# EAGLE design untitled (EAGLE 7.4.0)
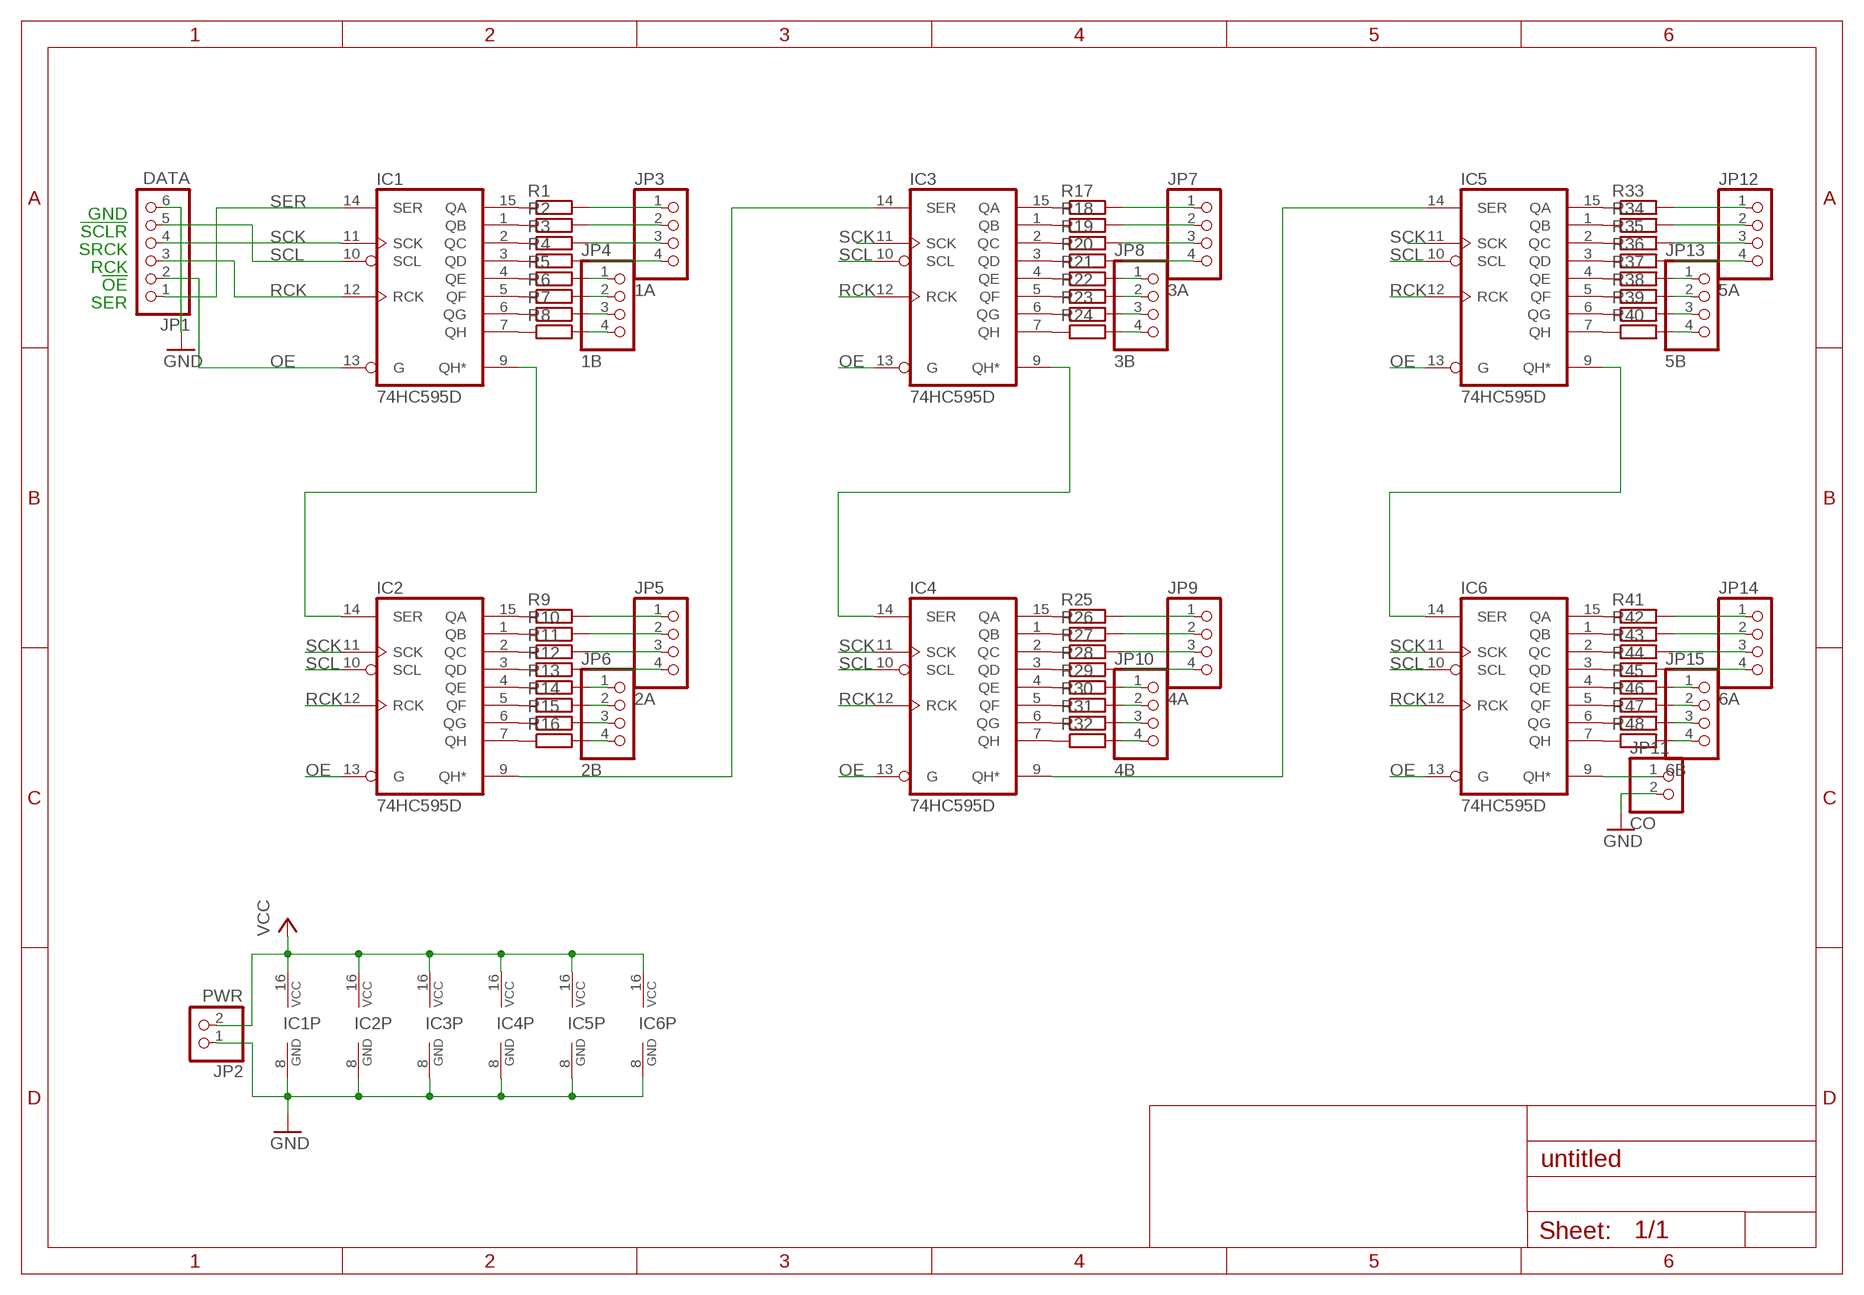
[diagram p0: schematic, sheet 1]

## Parts
IC1  74HC595D  [SO16]
IC2  74HC595D  [SO16]
IC3  74HC595D  [SO16]
IC4  74HC595D  [SO16]
IC5  74HC595D  [SO16]
IC6  74HC595D  [SO16]
JP1  DATA  PINHD-1X6  [1X06]
JP2  PWR  PINHD-1X2  [1X02]
JP3  1A  PINHD-1X4  [1X04]
JP4  1B  PINHD-1X4  [1X04]
JP5  2A  PINHD-1X4  [1X04]
JP6  2B  PINHD-1X4  [1X04]
JP7  3A  PINHD-1X4  [1X04]
JP8  3B  PINHD-1X4  [1X04]
JP9  4A  PINHD-1X4  [1X04]
JP10  4B  PINHD-1X4  [1X04]
JP11  CO  PINHD-1X2  [1X02]
JP12  5A  PINHD-1X4  [1X04]
JP13  5B  PINHD-1X4  [1X04]
JP14  6A  PINHD-1X4  [1X04]
JP15  6B  PINHD-1X4  [1X04]
R1  R-EU_R0805  [R0805]
R2  R-EU_R0805  [R0805]
R3  R-EU_R0805  [R0805]
R4  R-EU_R0805  [R0805]
R5  R-EU_R0805  [R0805]
R6  R-EU_R0805  [R0805]
R7  R-EU_R0805  [R0805]
R8  R-EU_R0805  [R0805]
R9  R-EU_R0805  [R0805]
R10  R-EU_R0805  [R0805]
R11  R-EU_R0805  [R0805]
R12  R-EU_R0805  [R0805]
R13  R-EU_R0805  [R0805]
R14  R-EU_R0805  [R0805]
R15  R-EU_R0805  [R0805]
R16  R-EU_R0805  [R0805]
R17  R-EU_R0805  [R0805]
R18  R-EU_R0805  [R0805]
R19  R-EU_R0805  [R0805]
R20  R-EU_R0805  [R0805]
R21  R-EU_R0805  [R0805]
R22  R-EU_R0805  [R0805]
R23  R-EU_R0805  [R0805]
R24  R-EU_R0805  [R0805]
R25  R-EU_R0805  [R0805]
R26  R-EU_R0805  [R0805]
R27  R-EU_R0805  [R0805]
R28  R-EU_R0805  [R0805]
R29  R-EU_R0805  [R0805]
R30  R-EU_R0805  [R0805]
R31  R-EU_R0805  [R0805]
R32  R-EU_R0805  [R0805]
R33  R-EU_R0805  [R0805]
R34  R-EU_R0805  [R0805]
R35  R-EU_R0805  [R0805]
R36  R-EU_R0805  [R0805]
R37  R-EU_R0805  [R0805]
R38  R-EU_R0805  [R0805]
R39  R-EU_R0805  [R0805]
R40  R-EU_R0805  [R0805]
R41  R-EU_R0805  [R0805]
R42  R-EU_R0805  [R0805]
R43  R-EU_R0805  [R0805]
R44  R-EU_R0805  [R0805]
R45  R-EU_R0805  [R0805]
R46  R-EU_R0805  [R0805]
R47  R-EU_R0805  [R0805]
R48  R-EU_R0805  [R0805]

## Nets
GND: IC1.8(GND) IC2.8(GND) IC3.8(GND) IC4.8(GND) IC5.8(GND) IC6.8(GND) JP1.6 JP2.1 JP11.2
N$1: IC2.15(QA) R9.1
N$2: IC1.15(QA) R1.1
N$3: IC1.1(QB) R2.1
N$4: IC1.2(QC) R3.1
N$5: IC1.3(QD) R4.1
N$6: IC1.4(QE) R5.1
N$7: IC1.5(QF) R6.1
N$8: IC1.6(QG) R7.1
N$9: IC1.7(QH) R8.1
N$10: IC2.1(QB) R10.1
N$11: IC2.2(QC) R11.1
N$12: IC2.3(QD) R12.1
N$13: IC2.4(QE) R13.1
N$14: IC2.5(QF) R14.1
N$15: IC2.6(QG) R15.1
N$16: IC2.7(QH) R16.1
N$17: JP5.1 R9.2
N$18: JP5.2 R10.2
N$19: JP3.1 R1.2
N$20: JP3.2 R2.2
N$21: JP3.3 R3.2
N$22: JP3.4 R4.2
N$23: JP4.1 R5.2
N$24: JP4.2 R6.2
N$25: JP4.3 R7.2
N$26: JP4.4 R8.2
N$27: JP5.3 R11.2
N$28: JP5.4 R12.2
N$29: JP6.1 R13.2
N$30: JP6.2 R14.2
N$31: JP6.3 R15.2
N$32: JP6.4 R16.2
N$33: IC1.9(QH*) IC2.14(SER)
N$34: IC3.15(QA) R17.1
N$35: IC3.1(QB) R18.1
N$36: IC3.2(QC) R19.1
N$37: IC3.3(QD) R20.1
N$38: IC3.4(QE) R21.1
N$39: IC3.5(QF) R22.1
N$40: IC3.6(QG) R23.1
N$41: IC3.7(QH) R24.1
N$42: JP7.1 R17.2
N$43: JP7.2 R18.2
N$44: JP7.3 R19.2
N$45: JP7.4 R20.2
N$46: JP8.1 R21.2
N$47: JP8.2 R22.2
N$48: JP8.3 R23.2
N$49: JP8.4 R24.2
N$50: IC4.15(QA) R25.1
N$51: IC4.1(QB) R26.1
N$52: IC4.2(QC) R27.1
N$53: IC4.3(QD) R28.1
N$54: IC4.4(QE) R29.1
N$55: IC4.5(QF) R30.1
N$56: IC4.6(QG) R31.1
N$57: IC4.7(QH) R32.1
N$58: JP9.1 R25.2
N$59: JP9.2 R26.2
N$60: JP9.3 R27.2
N$61: JP9.4 R28.2
N$62: JP10.1 R29.2
N$63: JP10.2 R30.2
N$64: JP10.3 R31.2
N$65: JP10.4 R32.2
N$66: IC3.9(QH*) IC4.14(SER)
N$67: IC2.9(QH*) IC3.14(SER)
N$68: IC6.9(QH*) JP11.1
N$69: IC5.15(QA) R33.1
N$70: IC5.1(QB) R34.1
N$71: IC5.2(QC) R35.1
N$72: IC5.3(QD) R36.1
N$73: IC5.4(QE) R37.1
N$74: IC5.5(QF) R38.1
N$75: IC5.6(QG) R39.1
N$76: IC5.7(QH) R40.1
N$77: JP12.1 R33.2
N$78: JP12.2 R34.2
N$79: JP12.3 R35.2
N$80: JP12.4 R36.2
N$81: JP13.1 R37.2
N$82: JP13.2 R38.2
N$83: JP13.3 R39.2
N$84: JP13.4 R40.2
N$85: IC6.15(QA) R41.1
N$86: IC6.1(QB) R42.1
N$87: IC6.2(QC) R43.1
N$88: IC6.3(QD) R44.1
N$89: IC6.4(QE) R45.1
N$90: IC6.5(QF) R46.1
N$91: IC6.6(QG) R47.1
N$92: IC6.7(QH) R48.1
N$93: JP14.1 R41.2
N$94: JP14.2 R42.2
N$95: JP14.3 R43.2
N$96: JP14.4 R44.2
N$97: JP15.1 R45.2
N$98: JP15.2 R46.2
N$99: JP15.3 R47.2
N$100: JP15.4 R48.2
N$101: IC5.9(QH*) IC6.14(SER)
N$102: IC4.9(QH*) IC5.14(SER)
OE: IC1.13(G) IC2.13(G) IC3.13(G) IC4.13(G) IC5.13(G) IC6.13(G) JP1.2
RCK: IC1.12(RCK) IC2.12(RCK) IC3.12(RCK) IC4.12(RCK) IC5.12(RCK) IC6.12(RCK) JP1.3
SCK: IC1.11(SCK) IC2.11(SCK) IC3.11(SCK) IC4.11(SCK) IC5.11(SCK) IC6.11(SCK) JP1.4
SCL: IC1.10(SCL) IC2.10(SCL) IC3.10(SCL) IC4.10(SCL) IC5.10(SCL) IC6.10(SCL) JP1.5
SER: IC1.14(SER) JP1.1
VCC: IC1.16(VCC) IC2.16(VCC) IC3.16(VCC) IC4.16(VCC) IC5.16(VCC) IC6.16(VCC) JP2.2

## Notes on the sheet
- GND
- !SCLR
- SRCK
- RCK
- !OE
- SER

## Library data of the parts
IC1-IC6 = 74xx-eu:74*595: 8-bit SHIFT REGISTER, output latch
JP1 = pinhead:PINHD-1X6: PIN HEADER
JP2 JP11 = pinhead:PINHD-1X2: PIN HEADER
JP3-JP10 JP12-JP15 = pinhead:PINHD-1X4: PIN HEADER
R1-R48 = rcl:R-EU_: RESISTOR, European symbol

## Board
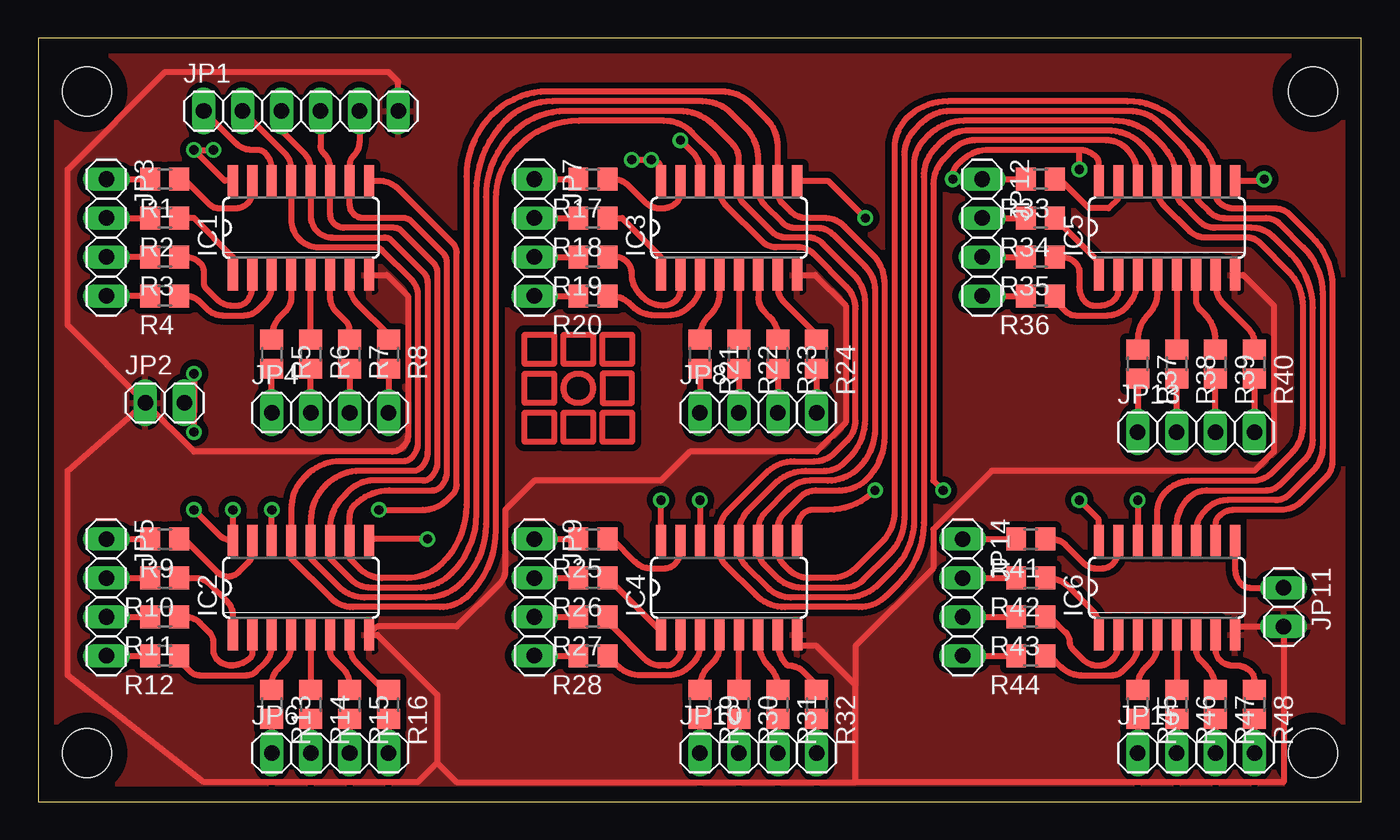
[diagram p1: board, top side]
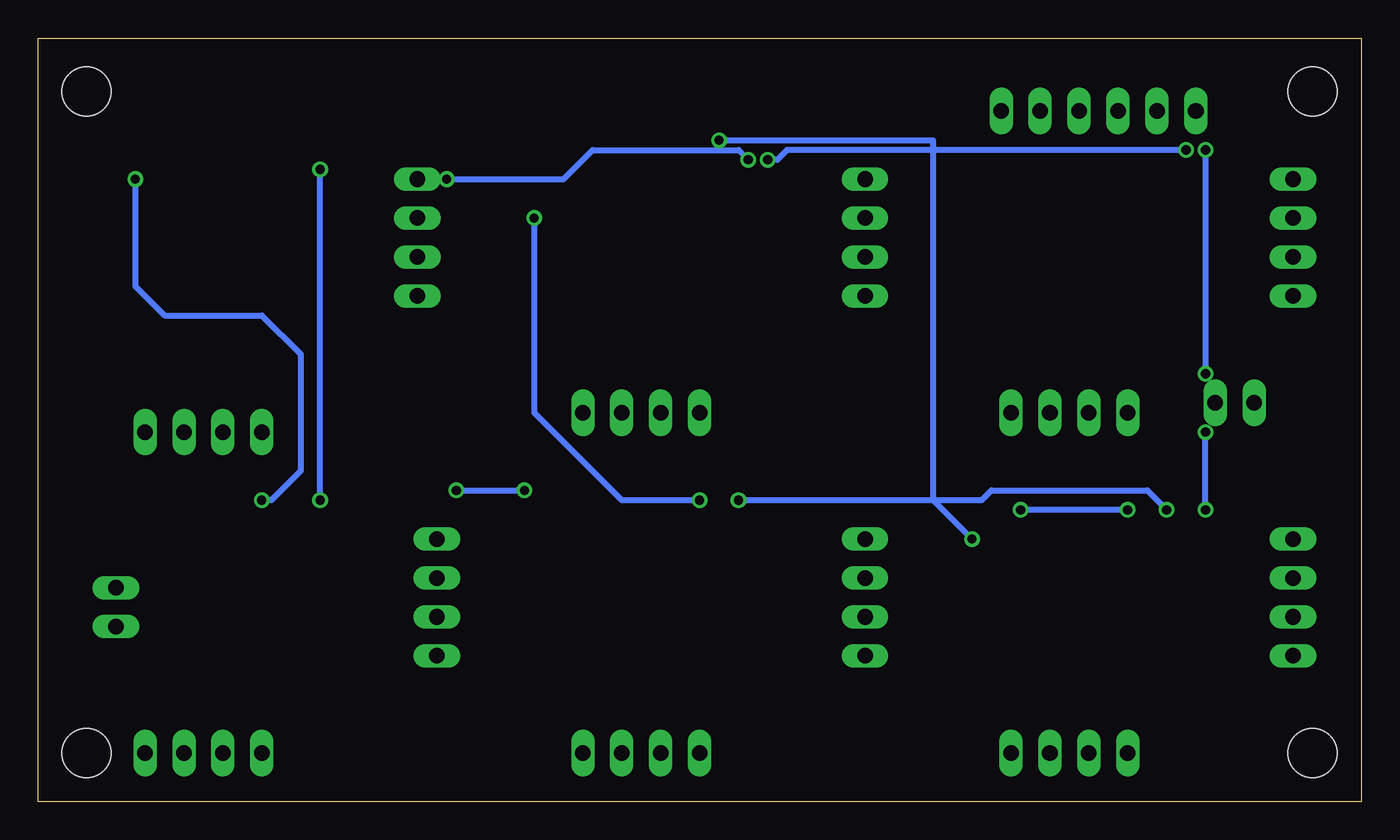
[diagram p2: board, bottom side, seen from below]

Size 86.34 x 49.84 mm. Coordinates in mm from the lower left corner, seen from the top.
Outline: 0,0 86.34,0 86.34,49.84 0,49.84 0,0
Copper layers (1*16): Top 0.035mm / dielectric 1.5mm / Bottom 0.035mm
Design rules "default": minimum track width 10mil, minimum drill 24mil, track to track 8mil, track to pad 8mil, pad to pad 8mil, via to via 8mil, smd to smd 8mil, copper to edge 40mil, drill to drill 8mil, minimum pad ring 10mil, minimum via ring 8mil, stop-mask expansion 4mil, vias tented up to drill 0mil, thermal gap 10mil
Holes 3.2 mm at 3.17,46.35 83.19,46.35 83.19,3.17 3.17,3.17

### Footprints (pad centres in the part's own frame; a part is rotated, then mirrored left to right if it is on the bottom)
SO16 = smd 0.66 x 2.032: 1 -4.445,-3.073; 2 -3.175,-3.073; 3 -1.905,-3.073; 4 -0.635,-3.073; 5 0.635,-3.073; 6 1.905,-3.073; 7 3.175,-3.073; 8 4.445,-3.073; 9 4.445,3.073; 10 3.175,3.073; 11 1.905,3.073; 12 0.635,3.073; 13 -0.635,3.073; 14 -1.905,3.073; 15 -3.175,3.073; 16 -4.445,3.073
1X06 = drill 1.016 long: 1 -6.35,0; 2 -3.81,0; 3 -1.27,0; 4 1.27,0; 5 3.81,0; 6 6.35,0
1X02 = drill 1.016 long: 1 -1.27,0; 2 1.27,0
1X04 = drill 1.016 long: 1 -3.81,0; 2 -1.27,0; 3 1.27,0; 4 3.81,0
R0805 = smd 1.3 x 1.5: 1 -0.95,0; 2 0.95,0

### Placement (x,y rotation side)
IC1  17.14,37.47 0 top
IC2  17.14,13.97 0 top
IC3  45.09,37.47 0 top
IC4  45.09,13.97 0 top
IC5  73.66,37.47 0 top
IC6  73.66,13.97 0 top
JP1  17.14,45.09 0 top
JP2  8.26,26.04 0 top
JP3  4.45,36.83 270 top
JP4  19.05,25.4 0 top
JP5  4.45,13.34 270 top
JP6  19.05,3.17 0 top
JP7  32.38,36.83 270 top
JP8  46.99,25.4 0 top
JP9  32.38,13.34 270 top
JP10  46.99,3.17 0 top
JP11  81.28,12.7 270 top
JP12  61.59,36.83 270 top
JP13  75.56,24.13 0 top
JP14  60.33,13.34 270 top
JP15  75.56,3.17 0 top
R1  8.26,40.64 180 top
R2  8.26,38.1 180 top
R3  8.26,35.56 180 top
R4  8.26,33.02 180 top
R5  15.24,29.21 270 top
R6  17.78,29.21 270 top
R7  20.32,29.21 270 top
R8  22.86,29.21 270 top
R9  8.26,17.14 180 top
R10  8.26,14.61 180 top
R11  8.26,12.06 180 top
R12  8.26,9.53 180 top
R13  15.24,6.35 270 top
R14  17.78,6.35 270 top
R15  20.32,6.35 270 top
R16  22.86,6.35 270 top
R17  36.2,40.64 180 top
R18  36.2,38.1 180 top
R19  36.2,35.56 180 top
R20  36.2,33.02 180 top
R21  43.18,29.21 270 top
R22  45.72,29.21 270 top
R23  48.26,29.21 270 top
R24  50.8,29.21 270 top
R25  36.2,17.14 180 top
R26  36.2,14.61 180 top
R27  36.2,12.06 180 top
R28  36.2,9.53 180 top
R29  43.18,6.35 270 top
R30  45.72,6.35 270 top
R31  48.26,6.35 270 top
R32  50.8,6.35 270 top
R33  65.41,40.64 180 top
R34  65.41,38.1 180 top
R35  65.41,35.56 180 top
R36  65.41,33.02 180 top
R37  71.75,28.57 270 top
R38  74.3,28.57 270 top
R39  76.83,28.57 270 top
R40  79.38,28.57 270 top
R41  64.77,17.14 180 top
R42  64.77,14.61 180 top
R43  64.77,12.06 180 top
R44  64.77,9.53 180 top
R45  71.75,6.35 270 top
R46  74.3,6.35 270 top
R47  76.83,6.35 270 top
R48  79.38,6.35 270 top

### Tracks (layer width: path | path; a pad name or v marks a point on that pad's centre or on a via)
GND
  Top 0.406: JP1.6 23.5,46.99 22.86,47.62 8.26,47.62 1.91,41.27 1.91,31.11 JP2.1 | IC1.8 22.76,34.39 24.13,33.02 24.13,23.87 arc-45 23.87,23.23 23.76,23.12 arc-45 23.12,22.86 10.16,22.86 JP2.1 | 26.04,2.54 24.77,1.27 10.79,1.27 1.91,8.26 1.91,21.59 JP2.1 | IC5.8 78.64,34.39 80.64,32.38 80.64,22.86 79.38,21.59 62.23,21.59 58.42,17.78 58.42,15.24 53.34,10.16 53.34,7.62 | 26.04,2.54 26.04,6.99 22.12,10.9 IC2.8 22.12,11.43 27.3,11.43 30.11,14.23 arc45 30.48,15.13 30.48,19.05 32.38,20.95 40.64,20.95 42.55,22.86 50.8,22.86 52.7,24.77 52.7,32.38 50.7,34.39 IC3.8 | 26.04,2.54 27.3,1.27 53.34,1.27 | 53.34,1.27 53.34,7.62 | 53.34,7.62 50.8,10.16 49.53,10.16 | IC6.8 78.11,11.43 JP11.2 81.28,1.27 53.34,1.27
  pour Top (isolate 0.406): 0,49.53 86.36,49.53 86.36,0 0,0
N$1
  Top 0.406: R9.1 9.53,17.14 11.67,15 arc90 13.09,15 13.71,15.61 arc45 13.97,16.25 IC2.15
N$2
  Top 0.406: R1.1 9.53,40.64 11.17,39 arc45 11.8,38.73 12.81,38.73 arc45 13.71,39.11 arc45 13.97,39.74 IC1.15
N$3
  Top 0.406: IC1.1 12.7,35.56 10.16,38.1 R2.1
N$4
  Top 0.406: R3.1 9.63,35.56 arc-45 10.53,35.19 10.61,35.11 arc-45 10.79,34.66 10.79,33.92 arc45 10.98,33.47 11.65,32.8 arc45 12.65,32.38 13.03,32.38 arc45 13.55,32.6 arc45 13.97,33.61 IC1.2
N$5
  Top 0.406: R4.1 9.63,33.02 arc-45 10.53,32.65 11.01,32.17 arc45 12.02,31.75 13.44,31.75 arc45 14.34,32.12 14.82,32.6 arc45 15.24,33.61 IC1.3
N$6
  Top 0.406: IC1.4 16.51,32.97 arc-45 16.09,31.97 15.77,31.64 arc45 15.24,30.37 R5.1
N$7
  Top 0.406: R6.1 IC1.5
N$8
  Top 0.406: R7.1 20.32,30.74 arc45 20.06,31.38 19.47,31.97 arc-45 19.05,32.97 IC1.6
N$9
  Top 0.406: R8.1 22.86,30.48 20.85,32.49 arc-45 20.32,33.76 IC1.7
N$10
  Top 0.406: R10.1 10.27,14.61 arc-45 11.17,14.23 12.28,13.12 arc-45 12.7,12.11 IC2.1
N$11
  Top 0.406: IC2.2 13.97,9.68 arc-45 13.86,9.42 arc-45 12.59,8.89 | 12.59,8.89 | 12.59,8.89 arc-45 11.69,9.26 arc-45 11.43,9.9 11.43,10.42 arc45 11.17,11.06 10.58,11.65 arc45 9.57,12.06 R11.1
N$12
  Top 0.406: R12.1 9.21,9.21 9.9,8.52 arc45 10.53,8.26 13.6,8.26 arc45 14.23,8.52 14.82,9.11 arc45 15.24,10.11 IC2.3
N$13
  Top 0.406: R13.1 15.24,7.67 arc-45 15.66,8.67 16.09,9.11 arc45 16.51,10.11 IC2.4
N$14
  Top 0.406: IC2.5 R14.1
N$15
  Top 0.406: R15.1 20.32,7.67 arc45 19.9,8.67 19.24,9.34 arc-45 19.05,9.79 IC2.6
N$16
  Top 0.406: R16.1 22.55,7.3 20.85,9 arc-45 20.32,10.27 IC2.7
N$17
  Top 0.406: JP5.1 R9.2
N$18
  Top 0.406: JP5.2 R10.2
N$19
  Top 0.406: JP3.1 R1.2
N$20
  Top 0.406: JP3.2 R2.2
N$21
  Top 0.406: R3.2 JP3.3
N$22
  Top 0.406: R4.2 JP3.4
N$23
  Top 0.406: JP4.1 R5.2
N$24
  Top 0.406: JP4.2 R6.2
N$25
  Top 0.406: R7.2 JP4.3
N$26
  Top 0.406: R8.2 JP4.4
N$27
  Top 0.406: JP5.3 R11.2
N$28
  Top 0.406: JP5.4 R12.2
N$29
  Top 0.406: R13.2 JP6.1
N$30
  Top 0.406: R14.2 JP6.2
N$31
  Top 0.406: R15.2 JP6.3
N$32
  Top 0.406: R16.2 JP6.4
N$33  (via drill 0.6 pad 1.02)
  Top 0.406: IC1.9 22.21,40.54 arc-45 23.49,40.01 27.04,36.46 arc-45 27.3,35.82 27.3,20.69 arc-45 27.04,20.06 26.71,19.72 arc-45 25.09,19.05 v22.23,19.05 | IC2.14 v15.24,19.05
  Bottom 0.406: v15.24,19.05 v22.23,19.05
N$34
  Top 0.406: R17.1 37.57,40.64 arc-45 38.47,40.27 39.59,39.15 arc45 40.59,38.73 40.69,38.73 arc45 41.69,39.15 arc45 41.91,39.68 IC3.15
N$35
  Top 0.406: R18.1 38.1,38.1 40.64,35.56 IC3.1
N$36
  Top 0.406: IC3.2 41.91,33.44 arc-45 41.62,32.73 arc-45 40.79,32.38 arc-45 39.45,32.94 39.32,33.07 arc-45 38.73,34.49 arc45 38.42,35.23 arc45 37.64,35.56 R19.1
N$37
  Top 0.406: IC3.3 43.18,33.76 arc-45 42.65,32.49 42.47,32.31 arc-45 41.12,31.75 40.2,31.75 arc-45 38.78,32.34 38.69,32.43 arc45 37.27,33.02 R20.1
N$38
  Top 0.406: IC3.4 44.45,33.17 arc-45 43.89,31.83 43.71,31.64 arc45 43.18,30.37 R21.1
N$39
  Top 0.406: IC3.5 R22.1
N$40
  Top 0.406: IC3.6 46.99,32.91 arc45 47.36,32.01 47.73,31.64 arc-45 48.26,30.37 R23.1
N$41
  Top 0.406: IC3.7 48.26,33.55 arc45 48.63,32.65 50.8,30.48 R24.1
N$42
  Top 0.406: JP7.1 R17.2
N$43
  Top 0.406: JP7.2 R18.2
N$44
  Top 0.406: JP7.3 R19.2
N$45
  Top 0.406: JP7.4 R20.2
N$46
  Top 0.406: R21.2 JP8.1
N$47
  Top 0.406: R22.2 JP8.2
N$48
  Top 0.406: R23.2 JP8.3
N$49
  Top 0.406: R24.2 JP8.4
N$50
  Top 0.406: R25.1 37.47,17.14 38.95,15.66 arc45 39.96,15.24 40.9,15.24 arc45 41.54,15.5 arc45 41.91,16.4 IC4.15
N$51
  Top 0.406: IC4.1 40.64,11.11 R26.1
N$52
  Top 0.406: IC4.2 41.91,9.79 arc-45 41.72,9.34 41.46,9.08 arc-45 41.01,8.89 40.59,8.89 arc-45 39.59,9.31 37.47,11.43 37.47,11.74 R27.1
N$53
  Top 0.406: IC4.3 43.18,10.11 arc-45 42.76,9.11 42.44,8.78 arc-45 41.17,8.26 39.3,8.26 arc-45 37.79,8.88 R28.1
N$54
  Top 0.406: IC4.4 44.45,10.11 arc-45 44.03,9.11 43.71,8.78 arc45 43.18,7.51 R29.1
N$55
  Top 0.406: R30.1 IC4.5
N$56
  Top 0.406: IC4.6 46.99,10.47 arc45 47.66,8.85 47.7,8.81 arc-45 48.26,7.47 R31.1
N$57
  Top 0.406: IC4.7 48.26,10.36 arc45 48.85,8.94 arc45 48.96,8.89 arc-45 49.93,8.49 50.8,7.62 R32.1
N$58
  Top 0.406: JP9.1 R25.2
N$59
  Top 0.406: JP9.2 R26.2
N$60
  Top 0.406: JP9.3 R27.2
N$61
  Top 0.406: JP9.4 R28.2
N$62
  Top 0.406: R29.2 JP10.1
N$63
  Top 0.406: JP10.2 R30.2
N$64
  Top 0.406: JP10.3 R31.2
N$65
  Top 0.406: JP10.4 R32.2
N$66  (via drill 0.6 pad 1.02)
  Top 0.406: IC3.9 51.54,40.54 v53.98,38.1 | v43.18,19.68 IC4.14
  Bottom 0.406: v53.98,38.1 53.98,25.4 48.26,19.68 v43.18,19.68
N$67  (via drill 0.6 pad 1.02)
  Top 0.406: IC3.14 43.18,41.32 arc45 42.76,42.33 v41.91,43.18 | v25.4,17.14 21.69,17.14 IC2.9
  Bottom 0.406: v41.91,43.18 27.94,43.18 27.94,19.68 v25.4,17.14
N$68
  Top 0.406: JP11.1 79.05,13.97 arc-45 78.52,14.19 arc-45 78.11,15.19 IC6.9
N$69
  Top 0.406: IC5.15 70.48,39.37 69.85,38.73 68.58,38.73 66.67,40.64 R33.1
N$70
  Top 0.406: IC5.1 69.22,35.24 R34.1
N$71
  Top 0.406: R35.1 66.78,35.56 arc-45 67.68,35.19 arc-45 67.94,34.55 67.94,33.61 arc45 68.36,32.6 arc45 68.89,32.38 69.26,32.38 arc45 70.27,32.8 arc45 70.48,33.33 IC5.2
N$72
  Top 0.406: R36.1 66.36,32.7 67.05,32.01 arc45 67.68,31.75 69.77,31.75 arc45 70.99,32.25 arc45 71.75,34.1 IC5.3
N$73
  Top 0.406: IC5.4 73.03,33.22 arc-45 72.44,31.8 arc45 71.75,30.15 R37.1
N$74
  Top 0.406: IC5.5 R38.1
N$75
  Top 0.406: R39.1 76.83,30.17 arc45 76.16,31.79 75.83,32.12 arc-45 75.56,32.76 IC5.6
N$76
  Top 0.406: IC5.7 76.83,33.76 arc45 77.36,32.49 78.96,30.9 arc-45 79.38,29.89 R40.1
N$77
  Top 0.406: JP12.1 R33.2
N$78
  Top 0.406: JP12.2 R34.2
N$79
  Top 0.406: JP12.3 R35.2
N$80
  Top 0.406: JP12.4 R36.2
N$81
  Top 0.406: R37.2 JP13.1
N$82
  Top 0.406: JP13.2 R38.2
N$83
  Top 0.406: JP13.3 R39.2
N$84
  Top 0.406: R40.2 JP13.4
N$85
  Top 0.406: R41.1 66.15,17.14 arc-45 67.05,16.77 68.32,15.5 arc45 68.95,15.24 69.48,15.24 arc45 70.11,15.5 arc45 70.48,16.4 IC6.15
N$86
  Top 0.406: R42.1 65.89,14.61 arc-45 67.23,14.05 68.8,12.48 arc-45 69.22,11.48 IC6.1
N$87
  Top 0.406: R43.1 66.04,12.06 67.05,11.06 arc-45 67.31,10.42 arc45 67.5,9.97 68.16,9.31 arc45 69.17,8.89 arc90 70.48,10.21 IC6.2
N$88
  Top 0.406: R44.1 66.04,9.53 66.78,8.78 arc45 68.05,8.26 70.11,8.26 arc45 70.75,8.52 71.34,9.11 arc45 71.75,10.11 IC6.3
N$89
  Top 0.406: R45.1 71.75,7.51 arc-45 72.28,8.78 72.61,9.11 arc45 73.03,10.11 IC6.4
N$90
  Top 0.406: IC6.5 R46.1
N$91
  Top 0.406: IC6.6 75.56,9.9 arc45 75.83,9.26 76.16,8.93 arc-45 R47.1
N$92
  Top 0.406: IC6.7 76.83,9.9 arc45 77.1,9.26 arc45 78,8.89 78.21,8.89 arc-45 79.11,8.52 arc-45 79.38,7.88 R48.1
N$93
  Top 0.406: JP14.1 R41.2
N$94
  Top 0.406: JP14.2 R42.2
N$95
  Top 0.406: JP14.3 R43.2
N$96
  Top 0.406: JP14.4 R44.2
N$97
  Top 0.406: R45.2 JP15.1
N$98
  Top 0.406: R46.2 JP15.2
N$99
  Top 0.406: R47.2 JP15.3
N$100
  Top 0.406: R48.2 JP15.4
N$101  (via drill 0.6 pad 1.02)
  Top 0.406: IC5.9 79.91,40.54 v80.01,40.64 | v71.75,19.68 IC6.14
  Bottom 0.406: v80.01,40.64 80.01,33.66 78.11,31.75 71.75,31.75 69.22,29.21 69.22,21.59 71.12,19.68 v71.75,19.68
N$102  (via drill 0.6 pad 1.02)
  Top 0.406: IC5.14 71.75,40.9 arc45 71.04,42.62 arc45 69.7,43.18 61.11,43.18 arc45 59.77,42.62 59.09,41.95 arc45 58.42,40.33 58.42,20.95 v59.05,20.32 | v54.61,20.32 arc-45 51.54,19.05 50.54,19.05 arc45 49.9,18.79 arc45 49.53,17.89 IC4.9
  Bottom 0.406: v59.05,20.32 v54.61,20.32
N$103
  Top 0.406: 33.66,27.94 33.66,26.04 31.75,26.04 31.75,27.94 33.66,27.94
N$104
  Top 0.406: 36.2,27.04 36.2,26.93 arc-90 35.3,26.04 35.19,26.04 arc-90 34.29,26.93 34.29,27.04 arc-90 35.19,27.94 35.3,27.94 arc-90 36.2,27.04
N$105
  Top 0.406: 36.83,27.94 36.83,26.04 38.73,26.04 38.73,27.94 36.83,27.94
N$106
  Top 0.406: 31.75,25.4 33.66,25.4 33.66,23.5 31.75,23.5 31.75,25.4
N$107
  Top 0.406: 34.29,25.4 36.2,25.4 36.2,23.5 34.29,23.5 34.29,25.4
N$108
  Top 0.406: 36.83,23.5 36.83,25.4 38.73,25.4 38.73,23.5 36.83,23.5
N$109
  Top 0.406: 31.75,30.48 33.66,30.48 33.66,28.57 31.75,28.57 31.75,30.48
N$110
  Top 0.406: 34.29,30.48 36.2,30.48 36.2,28.57 34.29,28.57 34.29,30.48
N$111
  Top 0.406: 36.83,30.48 38.73,30.48 38.73,28.57 36.83,28.57 36.83,30.48
OE
  Top 0.406: JP1.2 16.09,42.33 arc-45 16.51,41.32 IC1.13 16.51,37.99 arc90 18.31,36.2 21.96,36.2 arc-45 22.41,36.01 24.35,34.07 arc-45 24.77,33.07 24.77,23.45 arc-45 24.35,22.44 arc-45 23.82,22.23 19.73,22.23 arc45 17.48,21.3 17.34,21.15 arc45 16.51,19.14 IC2.13 16.51,15.88 19.1,13.29 arc45 20.52,12.7 26.22,12.7 arc45 28.07,13.47 arc45 29.84,17.75 29.84,39.38 arc-45 31.19,42.62 31.43,42.86 arc-45 35.27,44.45 40.83,44.45 arc-45 42.68,43.68 44.03,42.33 arc-45 44.45,41.32 IC3.13 44.45,39.96 arc45 44.87,38.95 47.25,36.57 arc45 48.15,36.2 49.58,36.2 arc-45 50.58,35.78 52.75,33.61 arc-45 53.34,32.19 53.34,24.87 arc-45 52.81,23.6 51.99,22.78 arc-45 50.65,22.23 49.34,22.23 arc45 47.49,21.46 45.04,19 arc45 44.45,17.58 IC4.13 44.45,16.4 arc45 44.82,15.5 46.84,13.49 arc45 48.74,12.7 53.56,12.7 arc45 55.35,13.44 56.12,14.21 arc45 57.78,18.23 57.78,40.79 arc-45 58.57,42.7 58.95,43.07 arc-45 60.74,43.81 69.78,43.81 arc-45 72.07,42.87 arc-45 73.03,40.56 IC5.13 73.03,39.96 arc45 73.44,38.95 75.15,37.25 arc45 76.15,36.83 78.85,36.83 arc-45 79.75,36.46 81.62,34.59 arc-45 82.55,32.34 82.55,24.61 arc-45 81.76,22.71 80.6,21.54 arc-45 79.18,20.95 75.24,20.95 arc45 73.62,20.28 arc45 73.03,18.84 IC6.13
RCK
  Top 0.406: JP1.3 15.88,43.81 17.36,42.33 arc-45 17.78,41.32 IC1.12 17.78,38.25 arc90 19.2,36.83 22.6,36.83 arc-45 23.05,36.64 25.14,34.55 arc-45 25.4,33.92 25.4,22.81 arc-45 24.98,21.81 arc-45 24.45,21.59 21,21.59 arc45 18.75,20.66 18.71,20.61 arc45 17.78,18.37 IC2.12 17.78,15.88 19.65,14.01 arc45 21.27,13.34 25.33,13.34 arc45 27.62,14.28 arc45 29.21,18.13 29.21,39.48 arc-45 30.93,43.62 arc-45 34.45,45.09 41.84,45.09 arc-45 44.13,44.14 45.3,42.96 arc-45 45.72,41.96 IC3.12 45.72,39.74 arc45 45.98,39.11 47.89,37.2 arc45 48.79,36.83 50.21,36.83 arc-45 51.22,36.41 53.21,34.42 arc-45 53.98,32.57 53.98,24.98 arc-45 52.92,22.44 52.63,22.15 arc-45 51.28,21.59 50.07,21.59 arc45 48.06,20.76 46.39,19.09 arc45 45.72,17.47 IC4.12 45.72,16.46 arc45 46.14,15.46 47.67,13.92 arc45 49.09,13.34 52.8,13.34 arc45 54.81,14.17 55.84,15.2 arc45 57.15,18.37 57.15,41.6 arc-45 57.82,43.22 58.11,43.5 arc-45 60.4,44.45 70.18,44.45 arc-45 72.87,43.33 73.33,42.88 arc-45 IC5.12 74.3,39.74 arc45 74.56,39.11 75.78,37.88 arc45 76.79,37.47 79.18,37.47 arc-45 80.6,36.88 81.73,35.74 arc-45 83.19,32.24 83.19,23.6 arc-45 82.66,22.33 81.02,20.69 arc-45 80.12,20.32 76.25,20.32 arc45 75.08,19.84 arc45 74.3,17.93 IC6.12
SCK
  Top 0.406: JP1.4 18.41,42.81 arc45 18.6,42.36 18.63,42.33 arc-45 19.05,41.32 IC1.11 19.05,38.36 arc90 19.95,37.47 23.23,37.47 arc-45 23.68,37.28 25.77,35.19 arc-45 26.04,34.55 26.04,22.18 arc-45 25.62,21.17 arc-45 25.09,20.95 21.64,20.95 arc45 20.02,20.02 19.82,19.82 arc45 19.05,17.97 IC2.11 19.05,15.88 20.43,14.5 arc45 21.7,13.97 24.69,13.97 arc45 26.98,14.92 arc45 28.57,18.76 28.57,39.84 arc-45 30.49,44.46 arc-45 33.53,45.72 43.37,45.72 arc-45 45.22,44.95 46.16,44.01 arc-45 46.99,42 IC3.11 46.99,39.96 arc45 47.41,38.95 48.52,37.84 arc45 49.42,37.47 50.85,37.47 arc-45 51.85,37.05 53.94,34.96 arc-45 54.61,33.34 54.61,24.38 arc-45 53.54,21.79 arc-45 51.53,20.95 50.36,20.95 arc45 48.94,20.37 47.41,18.83 arc45 46.99,17.83 IC4.11 46.99,16.4 arc45 47.36,15.5 48.22,14.64 arc45 49.84,13.97 52.6,13.97 arc45 53.87,14.5 55.51,16.14 arc45 56.52,18.56 56.52,42.23 arc-45 57.19,43.85 57.65,44.32 arc-45 59.5,45.09 71.21,45.09 arc-45 73.22,44.25 74.59,42.88 arc-45 IC5.11 75.56,39.63 arc45 75.75,39.18 76.42,38.52 arc45 77.42,38.1 80.12,38.1 arc-45 81.02,37.73 82.57,36.17 arc-45 83.82,33.16 83.82,23.17 arc-45 83.15,21.55 81.65,20.06 arc-45 80.75,19.68 77.62,19.68 arc45 76.28,19.13 76.09,18.94 arc45 75.56,17.67 IC6.11
SCL
  Top 0.406: JP1.5 20.95,43.07 arc-45 20.58,42.17 arc45 20.32,41.54 IC1.10 20.32,39 arc90 21.22,38.1 23.87,38.1 arc-45 24.32,37.91 26.41,35.82 arc-45 26.67,35.19 26.67,21.54 arc-45 26.25,20.54 arc-45 25.73,20.32 22.91,20.32 arc45 20.66,19.39 arc45 20.32,18.57 IC2.10 20.32,15.88 21,15.19 arc45 22.42,14.61 24.06,14.61 arc45 26.35,15.55 arc45 27.94,19.4 27.94,40.81 arc-45 29.62,44.86 arc-45 33.24,46.35 44.64,46.35 arc-45 46.49,45.59 47.59,44.49 arc-45 48.26,42.87 IC3.10 48.26,39.74 arc45 48.52,39.11 49.11,38.52 arc45 50.12,38.1 51.28,38.1 arc-45 52.63,37.54 54.46,35.71 arc-45 55.24,33.81 55.24,23.84 arc-45 54.11,21.09 arc-45 52.26,20.32 50.75,20.32 arc45 49.75,19.9 48.68,18.83 arc45 48.26,17.83 IC4.10 48.26,16.46 arc45 48.68,15.46 49,15.13 arc45 50.27,14.61 51.76,14.61 arc45 53.38,15.28 55.05,16.95 arc45 55.88,18.96 55.88,42.7 arc-45 56.67,44.6 arc-45 59.36,45.72 71.11,45.72 arc-45 74.38,44.37 75.86,42.88 arc-45 IC5.10 76.83,39.63 arc45 77.02,39.18 77.05,39.15 arc45 78.06,38.73 80.69,38.73 arc-45 81.7,38.32 83.11,36.9 arc-45 84.45,33.66 84.45,22.18 arc-45 84.04,21.17 82.5,19.64 arc-45 81.08,19.05 78.06,19.05 arc45 77.05,18.63 arc45 76.83,18.11 IC6.10
SER
  Top 0.406: IC1.14 15.24,41.32 arc45 14.82,42.33 arc45 14.29,42.55 13.92,42.55 arc-45 12.92,42.96 JP1.1
VCC  (via drill 0.6 pad 1.02)
  Top 0.406: v10.16,27.94 10.16,25.4 | 10.16,25.4 JP2.2 | v10.16,19.05 11.79,17.42 arc45 IC2.16 v12.7,19.05 | v10.16,24.13 10.16,25.4 | IC3.16 40.64,41.27 arc90 v40.01,41.91 v38.73,41.91 | IC5.16 69.22,41.65 arc45 69.03,42.1 arc45 67.94,42.55 | 67.94,42.55 62.04,42.55 arc45 60.19,41.78 59.95,41.54 arc45 59.69,40.9 v59.69,40.64 | IC1.16 12.17,40.54 v10.16,42.55 v11.43,42.55 | IC4.16 v40.64,19.68 | IC6.16 69.22,18.41 v67.94,19.68 | v67.94,41.27 67.94,42.55
  Bottom 0.406: v10.16,42.55 v10.16,27.94 | v10.16,19.05 v10.16,24.13 | v59.69,40.64 52.07,40.64 50.16,42.55 40.64,42.55 v40.01,41.91 | v11.43,42.55 37.47,42.55 38.1,41.91 v38.73,41.91 | v40.64,19.68 24.77,19.68 24.13,20.32 13.97,20.32 v12.7,19.05 | v67.94,19.68 v67.94,41.27